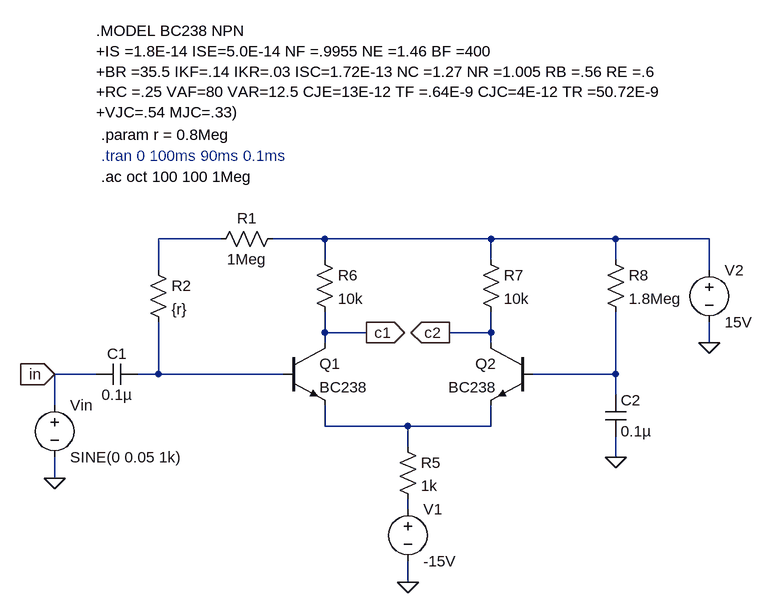
[diagram p0: schematic exercise1_8.asc]
exercise1_8.asc, the LTspice schematic file:
Version 4.1
SHEET 1 1016 680
WIRE 192 -288 96 -288
WIRE 352 -288 272 -288
WIRE 608 -288 352 -288
WIRE 800 -288 608 -288
WIRE 944 -288 800 -288
WIRE 352 -256 352 -288
WIRE 608 -256 608 -288
WIRE 800 -256 800 -288
WIRE 96 -240 96 -288
WIRE 944 -240 944 -288
WIRE 352 -144 352 -176
WIRE 416 -144 352 -144
WIRE 608 -144 608 -176
WIRE 608 -144 544 -144
WIRE 352 -128 352 -144
WIRE 608 -128 608 -144
WIRE 944 -128 944 -160
WIRE 0 -80 -64 -80
WIRE 96 -80 96 -160
WIRE 96 -80 64 -80
WIRE 288 -80 96 -80
WIRE 800 -80 800 -176
WIRE 800 -80 672 -80
WIRE 800 -48 800 -80
WIRE -64 -32 -64 -80
WIRE 352 0 352 -32
WIRE 480 0 352 0
WIRE 608 0 608 -32
WIRE 608 0 480 0
WIRE 480 32 480 0
WIRE 800 48 800 16
WIRE -64 80 -64 48
WIRE 480 128 480 112
WIRE 480 240 480 208
FLAG 800 48 0
FLAG 480 240 0
FLAG 944 -128 0
FLAG 416 -144 c1
IOPIN 416 -144 Out
FLAG 544 -144 c2
IOPIN 544 -144 Out
FLAG -64 80 0
FLAG -64 -80 in
IOPIN -64 -80 In
SYMBOL res 464 16 R0
SYMATTR InstName R5
SYMATTR Value 1k
SYMBOL res 336 -272 R0
SYMATTR InstName R6
SYMATTR Value 10k
SYMBOL res 592 -272 R0
SYMATTR InstName R7
SYMATTR Value 10k
SYMBOL res 784 -272 R0
SYMATTR InstName R8
SYMATTR Value 1.8Meg
SYMBOL voltage 480 112 R0
SYMATTR InstName V1
SYMATTR Value -15V
SYMBOL voltage 944 -256 R0
SYMATTR InstName V2
SYMATTR Value 15V
SYMBOL npn 288 -128 R0
SYMATTR InstName Q1
SYMATTR Value BC238
SYMBOL npn 672 -128 M0
SYMATTR InstName Q2
SYMATTR Value BC238
SYMBOL res 288 -304 R90
WINDOW 0 0 56 VBottom 2
WINDOW 3 32 56 VTop 2
SYMATTR InstName R1
SYMATTR Value 1Meg
SYMBOL res 80 -256 R0
SYMATTR InstName R2
SYMATTR Value {r}
SYMBOL cap 64 -96 R90
WINDOW 0 0 32 VBottom 2
WINDOW 3 32 32 VTop 2
SYMATTR InstName C1
SYMATTR Value 0.1µ
SYMBOL voltage -64 -48 R0
WINDOW 123 0 0 Left 0
WINDOW 39 0 0 Left 0
SYMATTR InstName Vin
SYMATTR Value SINE(0 0.05 1k)
SYMBOL cap 784 -48 R0
SYMATTR InstName C2
SYMATTR Value 0.1µ
TEXT 0 -608 Left 2 !.MODEL BC238 NPN\n+IS =1.8E-14 ISE=5.0E-14 NF =.9955 NE =1.46 BF =400\n+BR =35.5 IKF=.14 IKR=.03 ISC=1.72E-13 NC =1.27 NR =1.005 RB =.56 RE =.6\n+RC =.25 VAF=80 VAR=12.5 CJE=13E-12 TF =.64E-9 CJC=4E-12 TR =50.72E-9\n+VJC=.54 MJC=.33)
TEXT 8 -416 Left 2 ;.tran 0 100ms 90ms 0.1ms
TEXT 8 -448 Left 2 !.param r = 0.8Meg
TEXT 8 -384 Left 2 !.ac oct 100 100 1Meg

The netlist it stands for:
* exercise1_8.asc
R5 N005 N006 1k
R6 N002 c1 10k
R7 N002 c2 10k
R8 N002 N004 1.8Meg
V1 N006 0 -15V
V2 N002 0 15V
Q1 c1 N003 N005 0 BC238
Q2 c2 N004 N005 0 BC238
R1 N002 N001 1Meg
R2 N001 N003 {r}
C1 N003 in 0.1µ
Vin in 0 SINE(0 0.05 1k)
C2 N004 0 0.1µ
.model NPN NPN
.model PNP PNP
.lib standard.bjt
.MODEL BC238 NPN
+IS =1.8E-14 ISE=5.0E-14 NF =.9955 NE =1.46 BF =400
+BR =35.5 IKF=.14 IKR=.03 ISC=1.72E-13 NC =1.27 NR =1.005 RB =.56 RE =.6
+RC =.25 VAF=80 VAR=12.5 CJE=13E-12 TF =.64E-9 CJC=4E-12 TR =50.72E-9
+VJC=.54 MJC=.33)
* .tran 0 100ms 90ms 0.1ms
.param r = 0.8Meg
.ac oct 100 100 1Meg
.backanno
.end